# Altium schematic sheet interface.SchDoc: USB Interface (part 2 of 3)
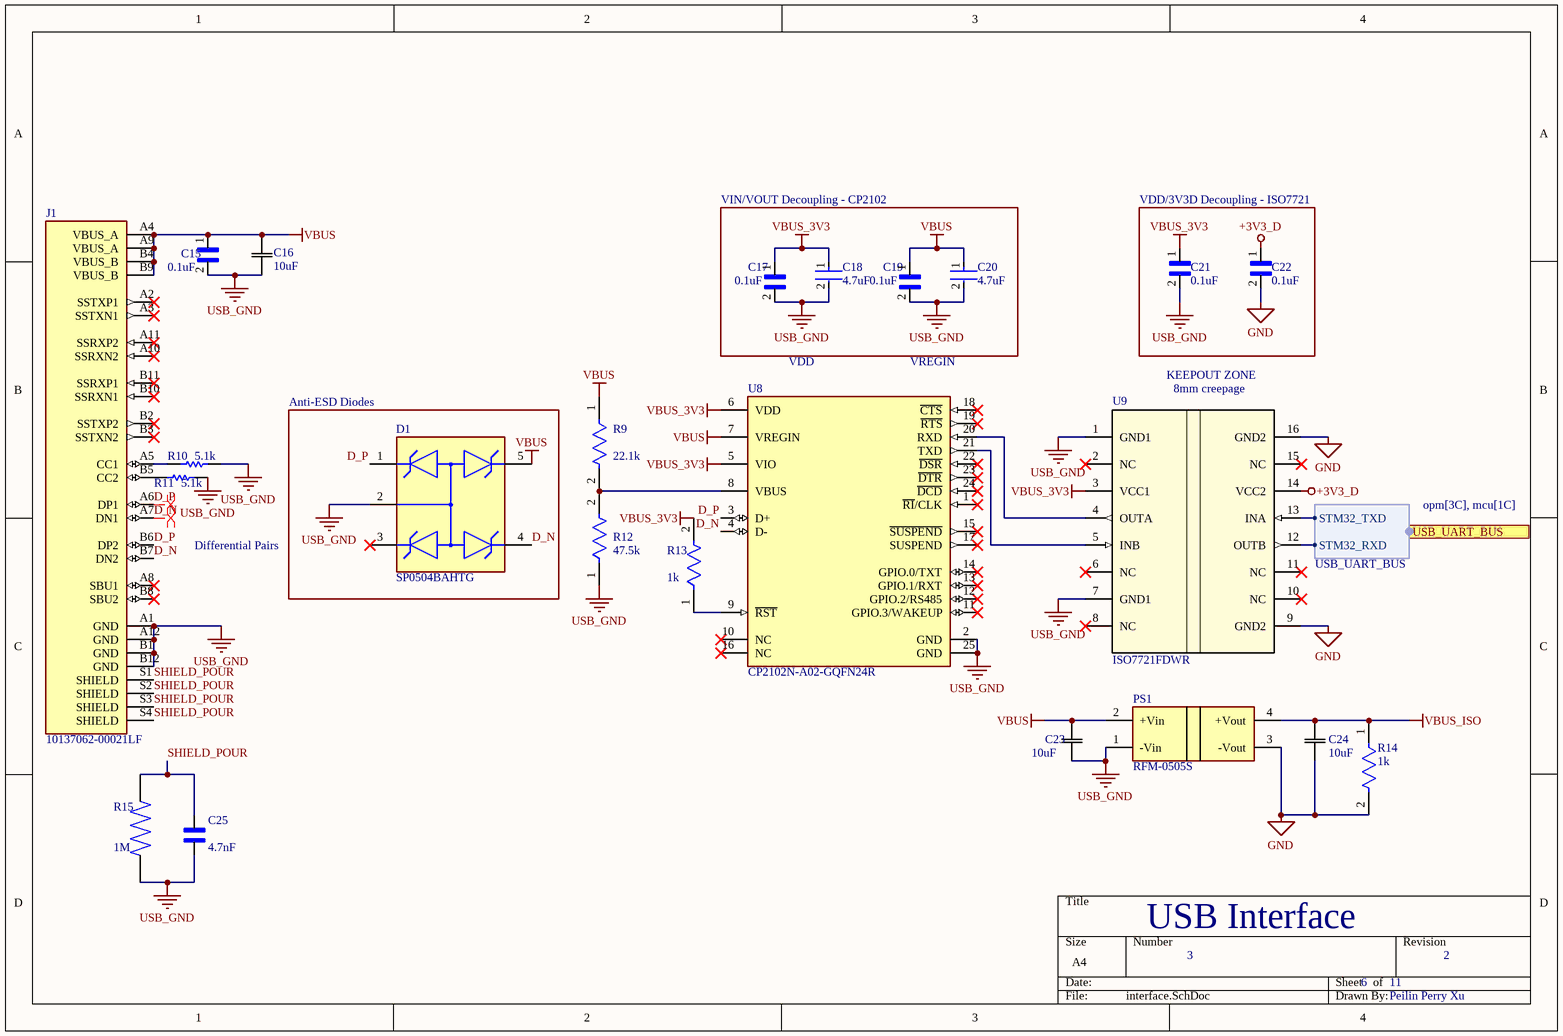
[diagram p1: interface.SchDoc]
## Library data of the parts
C15 C17 C19 C21 C22 = CC0603JRX7R8BB104: 25V 100nF X7R ±5% 0603 Multilayer Ceramic Capacitors MLCC - SMD/SMT ROHS; Manufacturer: Yageo Group; Supplier: DigiKey; Supplier Part Number: 311-1777-1-ND; Manufacturer Part Number: CC0603JRX7R8BB104; RoHS: Compliant; Category: Ceramic Capacitors; Stock: 156739; Pricing: 1=0.1, 10=0.056, 50=0.0386, 100=0.0333, 500=0.02444, 1000=0.02172 (USD); Value: 100nF; Case/Package: 0603; Case Code (Imperial): 0603; Case Code (Metric): 1608; China RoHS: Compliant; Composition: Ceramic; Depth: 800µm; Dielectric: X7R; Dielectric Material: Ceramic; Halogen Free: Halogen Free; Height: 800µm; Lead Free: Lead Free; Length: 1.6mm; Lifecycle Status: Production; Max Operating Temperature: 125°C; Min Operating Temperature: -55°C; Mounting Technology: Surface Mount; Number of Terminals: 2; Radiation Hardening: No; REACH SVHC: Yes; Schedule B: 8532240020, 8532240020|8532240020, 8532240020|8532240020|8532240020, 8532240020|8532240020|8532240020|8532240020; Termination: SMD/SMT; Thickness: 889µm; Tolerance: 5%; Voltage Rating: 25V; Voltage Rating (DC): 25V; Weight: 2.012816mg; Width: 800µm; ComponentLink1URL: https://datasheet.octopart.com:443/CC0603JRX7R8BB104-Yageo-datasheet-177165144.pdf?src-supplier=IHS; ComponentLink1Description: https://datasheet.octopart.com:443/CC0603JRX7R8BB104-Yageo-datasheet-177165144.pdf?src-supplier=IHS; ComponentLink2URL: https://datasheet.octopart.com:443/CC0603JRX7R8BB104-Yageo-datasheet-147453679.pdf?src-supplier=Farnell; ComponentLink2Description: https://datasheet.octopart.com:443/CC0603JRX7R8BB104-Yageo-datasheet-147453679.pdf?src-supplier=Farnell; ComponentLink3URL: https://datasheet.octopart.com:443/CC0603JRX7R8BB104-Yageo-datasheet-181968346.pdf?src-supplier=Farnell; ComponentLink3Description: https://datasheet.octopart.com:443/CC0603JRX7R8BB104-Yageo-datasheet-181968346.pdf?src-supplier=Farnell; ComponentLink4URL: https://datasheet.octopart.com:443/CC0603JRX7R8BB104-Yageo-datasheet-151948686.pdf?src-supplier=TME; ComponentLink4Description: https://datasheet.octopart.com:443/CC0603JRX7R8BB104-Yageo-datasheet-151948686.pdf?src-supplier=TME; ComponentLink5URL: https://datasheet.octopart.com/CC0603JRX7R8BB104-Yageo-datasheet-12526321.pdf; ComponentLink5Description: https://datasheet.octopart.com/CC0603JRX7R8BB104-Yageo-datasheet-12526321.pdf; ComponentLink6URL: https://datasheet.octopart.com/CC0603JRX7R8BB104-Yageo-datasheet-10883670.pdf; ComponentLink6Description: https://datasheet.octopart.com/CC0603JRX7R8BB104-Yageo-datasheet-10883670.pdf; ComponentLink7URL: https://datasheet.octopart.com:443/CC0603JRX7R8BB104-Yageo-datasheet-166511530.pdf?src-supplier=Future+Electronics; ComponentLink7Description: https://datasheet.octopart.com:443/CC0603JRX7R8BB104-Yageo-datasheet-166511530.pdf?src-supplier=Future+Electronics; ComponentLink8URL: https://datasheet.octopart.com:443/CC0603JRX7R8BB104-Yageo-datasheet-137700082.pdf?src-supplier=Future+Electronics; ComponentLink8Description: https://datasheet.octopart.com:443/CC0603JRX7R8BB104-Yageo-datasheet-137700082.pdf?src-supplier=Future+Electronics; ComponentLink9URL: https://datasheet.octopart.com:443/CC0603JRX7R8BB104-Yageo-datasheet-137700084.pdf?src-supplier=Future+Electronics; ComponentLink9Description: https://datasheet.octopart.com:443/CC0603JRX7R8BB104-Yageo-datasheet-137700084.pdf?src-supplier=Future+Electronics; ComponentLink10URL: https://datasheet.octopart.com:443/CC0603JRX7R8BB104-Yageo-datasheet-27626582.pdf?src-supplier=Future+Electronics; ComponentLink10Description: https://datasheet.octopart.com:443/CC0603JRX7R8BB104-Yageo-datasheet-27626582.pdf?src-supplier=Future+Electronics; ComponentLink11URL: https://datasheet.octopart.com:443/CC0603JRX7R8BB104-Yageo-datasheet-15895757.pdf?src-supplier=Future+Electronics; ComponentLink11Description: https://datasheet.octopart.com:443/CC0603JRX7R8BB104-Yageo-datasheet-15895757.pdf?src-supplier=Future+Electronics; ComponentLink12URL: https://datasheet.octopart.com:443/CC0603JRX7R8BB104-Yageo-datasheet-10911834.pdf?src-supplier=Future+Electronics; ComponentLink12Description: https://datasheet.octopart.com:443/CC0603JRX7R8BB104-Yageo-datasheet-10911834.pdf?src-supplier=Future+Electronics; ComponentLink13URL: https://datasheet.octopart.com:443/CC0603JRX7R8BB104-Yageo-datasheet-8324442.pdf?src-supplier=Future+Electronics; ComponentLink13Description: https://datasheet.octopart.com:443/CC0603JRX7R8BB104-Yageo-datasheet-8324442.pdf?src-supplier=Future+Electronics; ComponentLink14URL: https://datasheet.octopart.com:443/CC0603JRX7R8BB104-Yageo-Group-datasheet-165992755.pdf?src-supplier=ODG+(Origin+Data+Global); ComponentLink14Description: https://datasheet.octopart.com:443/CC0603JRX7R8BB104-Yageo-Group-datasheet-165992755.pdf?src-supplier=ODG+(Origin+Data+Global); ComponentLink15URL: http://sigma.octopart.com:80/rohs_statement/Surface-Mount-Ceramic-Multilayer-Capacitors%3B-General-Purpose-%26-High-Capacitance-Class-2%2C-X7R-Yageo-family-124.pdf?src-supplier=Compliance+Statements; ComponentLink15Description: http://sigma.octopart.com:80/rohs_statement/Surface-Mount-Ceramic-Multilayer-Capacitors%3B-General-Purpose-%26-High-Capacitance-Class-2%2C-X7R-Yageo-family-124.pdf?src-supplier=Compliance+Statements; ComponentLink16URL: http://sigma.octopart.com:80/reach_statement/Surface-Mount-Ceramic-Multilayer-Capacitors%3B-General-Purpose-%26-High-Capacitance-Class-2%2C-X7R-Yageo-family-125.pdf?src-supplier=Compliance+Statements; ComponentLink16Description: http://sigma.octopart.com:80/reach_statement/Surface-Mount-Ceramic-Multilayer-Capacitors%3B-General-Purpose-%26-High-Capacitance-Class-2%2C-X7R-Yageo-family-125.pdf?src-supplier=Compliance+Statements; ComponentLink17URL: http://sigma.octopart.com:80/conflict_mineral_statement/Yageo-company-3.pdf?src-supplier=Compliance+Statements; ComponentLink17Description: http://sigma.octopart.com:80/conflict_mineral_statement/Yageo-company-3.pdf?src-supplier=Compliance+Statements; ComponentLink18URL: http://sigma.octopart.com:80/rohs_statement/Yageo-company-2.pdf?src-supplier=Compliance+Statements; ComponentLink18Description: http://sigma.octopart.com:80/rohs_statement/Yageo-company-2.pdf?src-supplier=Compliance+Statements; Supplier 1: DigiKey; Supplier Part Number 1: 311-1777-1-ND
C16 C23 C24 = CC0805KKX7R7BB106: 16V 10uF X7R ±10% 0805 Multilayer Ceramic Capacitors MLCC - SMD/SMT ROHS; Manufacturer: Yageo Group; Value: 10µF; Supplier: DigiKey; Supplier Part Number: 311-3501-1-ND; Manufacturer Part Number: CC0805KKX7R7BB106; RoHS: Compliant; Category: Ceramic Capacitors; Stock: 2785; Pricing: 1=0.54, 10=0.329, 50=0.2472, 100=0.2222, 500=0.17992, 1000=0.16687 (USD); Case/Package: 0805; China RoHS: Compliant; Country of Origin: Mainland China, Taiwan; Dielectric: X7R; Dielectric Material: Ceramic; Export Control Classification Number (ECCN) Code: EAR99; Halogen Free: Halogen Free; Height: 1.25mm; Harmonized Tariff Schedule (HTS) Code: 8532.24.00.20; Introduction Date: 2013-05-20; Lead Free: Lead Free; Length: 2mm; Lifecycle Status: Production; Max Operating Temperature: 125°C; Min Operating Temperature: -55°C; Mounting Technology: Surface Mount; Number of Terminals: 2; REACH SVHC: Yes; Voltage Rating (DC): 16V; Width: 1.25mm; ComponentLink1URL: https://datasheet.octopart.com:443/CC0805KKX7R7BB106-Yageo-datasheet-177165144.pdf?src-supplier=IHS; ComponentLink1Description: https://datasheet.octopart.com:443/CC0805KKX7R7BB106-Yageo-datasheet-177165144.pdf?src-supplier=IHS; ComponentLink2URL: https://datasheet.octopart.com:443/CC0805KKX7R7BB106-Yageo-Group-datasheet-189192896.pdf?src-supplier=TME; ComponentLink2Description: https://datasheet.octopart.com:443/CC0805KKX7R7BB106-Yageo-Group-datasheet-189192896.pdf?src-supplier=TME; ComponentLink3URL: https://datasheet.octopart.com:443/CC0805KKX7R7BB106-Yageo-datasheet-147453679.pdf?src-supplier=Farnell; ComponentLink3Description: https://datasheet.octopart.com:443/CC0805KKX7R7BB106-Yageo-datasheet-147453679.pdf?src-supplier=Farnell; ComponentLink4URL: https://datasheet.octopart.com:443/CC0805KKX7R7BB106-Yageo-datasheet-181969636.pdf?src-supplier=Farnell; ComponentLink4Description: https://datasheet.octopart.com:443/CC0805KKX7R7BB106-Yageo-datasheet-181969636.pdf?src-supplier=Farnell; ComponentLink5URL: https://datasheet.octopart.com:443/CC0805KKX7R7BB106-Yageo-datasheet-151948686.pdf?src-supplier=Farnell; ComponentLink5Description: https://datasheet.octopart.com:443/CC0805KKX7R7BB106-Yageo-datasheet-151948686.pdf?src-supplier=Farnell; ComponentLink6URL: https://datasheet.octopart.com:443/CC0805KKX7R7BB106-Yageo-datasheet-166511530.pdf?src-supplier=Future+Electronics; ComponentLink6Description: https://datasheet.octopart.com:443/CC0805KKX7R7BB106-Yageo-datasheet-166511530.pdf?src-supplier=Future+Electronics; ComponentLink7URL: https://datasheet.octopart.com:443/CC0805KKX7R7BB106-Yageo-Group-datasheet-165992755.pdf?src-supplier=ODG+(Origin+Data+Global); ComponentLink7Description: https://datasheet.octopart.com:443/CC0805KKX7R7BB106-Yageo-Group-datasheet-165992755.pdf?src-supplier=ODG+(Origin+Data+Global); ComponentLink8URL: https://datasheet.octopart.com/CC0805KKX7R7BB106-Yageo-datasheet-10883670.pdf; ComponentLink8Description: https://datasheet.octopart.com/CC0805KKX7R7BB106-Yageo-datasheet-10883670.pdf; ComponentLink9URL: http://sigma.octopart.com:80/conflict_mineral_statement/Yageo-company-3.pdf?src-supplier=Compliance+Statements; ComponentLink9Description: http://sigma.octopart.com:80/conflict_mineral_statement/Yageo-company-3.pdf?src-supplier=Compliance+Statements; ComponentLink10URL: http://sigma.octopart.com:80/rohs_statement/Yageo-company-2.pdf?src-supplier=Compliance+Statements; ComponentLink10Description: http://sigma.octopart.com:80/rohs_statement/Yageo-company-2.pdf?src-supplier=Compliance+Statements; Supplier 1: DigiKey; Supplier Part Number 1: 311-3501-1-ND
C18 C20 = CC0805KKX7R7BB475: 16V 4.7uF X7R ±10% 0805 Multilayer Ceramic Capacitors MLCC - SMD/SMT ROHS; Manufacturer: Yageo Group; Manufacturer Package Identifier: CC0805-0.85; Value: 4.7µF; Supplier: DigiKey; Supplier Part Number: 311-1883-1-ND; Manufacturer Part Number: CC0805KKX7R7BB475; RoHS: Compliant; Category: Ceramic Capacitors; Stock: 16960; Pricing: 1=0.38, 10=0.224, 50=0.1656, 100=0.1475, 500=0.11696, 1000=0.10755 (USD); Case/Package: 0805; Case Code (Imperial): 0805; Case Code (Metric): 2012; China RoHS: Compliant; Composition: Ceramic; Dielectric: X7R; Dielectric Material: Ceramic; Halogen Free: Halogen Free; Height: 1.25mm; Lead Free: Lead Free; Length: 2mm; Lifecycle Status: Production; Material: Ceramic; Max Operating Temperature: 125°C; Min Operating Temperature: -55°C; Mounting Technology: Surface Mount; Number of Terminals: 2; Packaging: Tape & Reel (TR); REACH SVHC: Yes; Schedule B: 8532240020, 8532240020|8532240020, 8532240020|8532240020|8532240020, 8532240020|8532240020|8532240020|8532240020; Termination: SMD/SMT; Thickness: 1.4478mm; Tolerance: 10%; Voltage Rating: 16V; Voltage Rating (DC): 16V; Weight: 5.499807mg; Width: 1.25mm; ComponentLink1URL: https://datasheet.octopart.com:443/CC0805KKX7R7BB475-Yageo-datasheet-177165144.pdf?src-supplier=IHS; ComponentLink1Description: https://datasheet.octopart.com:443/CC0805KKX7R7BB475-Yageo-datasheet-177165144.pdf?src-supplier=IHS; ComponentLink2URL: https://datasheet.octopart.com:443/CC0805KKX7R7BB475-Yageo-datasheet-78855689.pdf?src-supplier=Upverter; ComponentLink2Description: https://datasheet.octopart.com:443/CC0805KKX7R7BB475-Yageo-datasheet-78855689.pdf?src-supplier=Upverter; ComponentLink3URL: https://datasheet.octopart.com:443/CC0805KKX7R7BB475-Yageo-datasheet-181969646.pdf?src-supplier=Newark; ComponentLink3Description: https://datasheet.octopart.com:443/CC0805KKX7R7BB475-Yageo-datasheet-181969646.pdf?src-supplier=Newark; ComponentLink4URL: https://datasheet.octopart.com:443/CC0805KKX7R7BB475-Yageo-datasheet-181969644.pdf?src-supplier=Newark; ComponentLink4Description: https://datasheet.octopart.com:443/CC0805KKX7R7BB475-Yageo-datasheet-181969644.pdf?src-supplier=Newark; ComponentLink5URL: https://datasheet.octopart.com:443/CC0805KKX7R7BB475-Yageo-datasheet-140260305.pdf?src-supplier=Newark; ComponentLink5Description: https://datasheet.octopart.com:443/CC0805KKX7R7BB475-Yageo-datasheet-140260305.pdf?src-supplier=Newark; ComponentLink6URL: https://datasheet.octopart.com:443/CC0805KKX7R7BB475-Yageo-datasheet-147453679.pdf?src-supplier=Newark; ComponentLink6Description: https://datasheet.octopart.com:443/CC0805KKX7R7BB475-Yageo-datasheet-147453679.pdf?src-supplier=Newark; ComponentLink7URL: https://datasheet.octopart.com:443/CC0805KKX7R7BB475-Yageo-Group-datasheet-188689702.pdf?src-supplier=Farnell; ComponentLink7Description: https://datasheet.octopart.com:443/CC0805KKX7R7BB475-Yageo-Group-datasheet-188689702.pdf?src-supplier=Farnell; ComponentLink8URL: https://datasheet.octopart.com:443/CC0805KKX7R7BB475-Yageo-datasheet-166511530.pdf?src-supplier=Future+Electronics; ComponentLink8Description: https://datasheet.octopart.com:443/CC0805KKX7R7BB475-Yageo-datasheet-166511530.pdf?src-supplier=Future+Electronics; ComponentLink9URL: https://datasheet.octopart.com:443/CC0805KKX7R7BB475-Yageo-datasheet-137700082.pdf?src-supplier=Future+Electronics; ComponentLink9Description: https://datasheet.octopart.com:443/CC0805KKX7R7BB475-Yageo-datasheet-137700082.pdf?src-supplier=Future+Electronics; ComponentLink10URL: https://datasheet.octopart.com:443/CC0805KKX7R7BB475-Yageo-datasheet-27626582.pdf?src-supplier=Future+Electronics; ComponentLink10Description: https://datasheet.octopart.com:443/CC0805KKX7R7BB475-Yageo-datasheet-27626582.pdf?src-supplier=Future+Electronics; ComponentLink11URL: https://datasheet.octopart.com:443/CC0805KKX7R7BB475-Yageo-Group-datasheet-165992755.pdf?src-supplier=ODG+(Origin+Data+Global); ComponentLink11Description: https://datasheet.octopart.com:443/CC0805KKX7R7BB475-Yageo-Group-datasheet-165992755.pdf?src-supplier=ODG+(Origin+Data+Global); ComponentLink12URL: https://datasheet.octopart.com:443/CC0805KKX7R7BB475-Yageo-datasheet-151948686.pdf?src-supplier=TME; ComponentLink12Description: https://datasheet.octopart.com:443/CC0805KKX7R7BB475-Yageo-datasheet-151948686.pdf?src-supplier=TME; ComponentLink13URL: https://datasheet.octopart.com/Surface-Mount-Ceramic-Multilayer-Capacitors%3B-General-Purpose-%26-High-Capacitance-Class-2%2C-X7R-Yageo-datasheet-family-114.pdf; ComponentLink13Description: https://datasheet.octopart.com/Surface-Mount-Ceramic-Multilayer-Capacitors%3B-General-Purpose-%26-High-Capacitance-Class-2%2C-X7R-Yageo-datasheet-family-114.pdf; ComponentLink14URL: https://datasheet.octopart.com/CC0805KKX7R7BB475-Yageo-datasheet-10883670.pdf; ComponentLink14Description: https://datasheet.octopart.com/CC0805KKX7R7BB475-Yageo-datasheet-10883670.pdf; ComponentLink15URL: http://sigma.octopart.com:80/rohs_statement/Surface-Mount-Ceramic-Multilayer-Capacitors%3B-General-Purpose-%26-High-Capacitance-Class-2%2C-X7R-Yageo-family-124.pdf?src-supplier=Compliance+Statements; ComponentLink15Description: http://sigma.octopart.com:80/rohs_statement/Surface-Mount-Ceramic-Multilayer-Capacitors%3B-General-Purpose-%26-High-Capacitance-Class-2%2C-X7R-Yageo-family-124.pdf?src-supplier=Compliance+Statements; ComponentLink16URL: http://sigma.octopart.com:80/reach_statement/Surface-Mount-Ceramic-Multilayer-Capacitors%3B-General-Purpose-%26-High-Capacitance-Class-2%2C-X7R-Yageo-family-125.pdf?src-supplier=Compliance+Statements; ComponentLink16Description: http://sigma.octopart.com:80/reach_statement/Surface-Mount-Ceramic-Multilayer-Capacitors%3B-General-Purpose-%26-High-Capacitance-Class-2%2C-X7R-Yageo-family-125.pdf?src-supplier=Compliance+Statements; ComponentLink17URL: http://sigma.octopart.com:80/conflict_mineral_statement/Yageo-company-3.pdf?src-supplier=Compliance+Statements; ComponentLink17Description: http://sigma.octopart.com:80/conflict_mineral_statement/Yageo-company-3.pdf?src-supplier=Compliance+Statements; ComponentLink18URL: http://sigma.octopart.com:80/rohs_statement/Yageo-company-2.pdf?src-supplier=Compliance+Statements; ComponentLink18Description: http://sigma.octopart.com:80/rohs_statement/Yageo-company-2.pdf?src-supplier=Compliance+Statements; Supplier 1: DigiKey; Supplier Part Number 1: 311-1883-6-ND
C25 = VJ1206Y472KXEAT5Z: Multilayer Ceramic Capacitor, 4700 pF, 500 V, ± 10%, X7R, 1206 [3216 Metric]; Manufacturer: Vishay; Voltage Rating: 500V; Supplier: DigiKey; Supplier Part Number: 720-1031-1-ND; Manufacturer Part Number: VJ1206Y472KXEAT5Z; RoHS: Compliant; Category: Ceramic Capacitors; Stock: 10395; Pricing: 1=1.07, 10=0.674, 50=0.5412, 100=0.4947, 500=0.4161, 1000=0.3918 (USD); Value: 4.7nF; Case/Package: 1206; Case Code (Imperial): 1206; Case Code (Metric): 3216; China RoHS: Compliant; Country of Origin: Israel; Dielectric: X7R; Dielectric Material: Ceramic; Export Control Classification Number (ECCN) Code: EAR99; Height: 1.7mm; Harmonized Tariff Schedule (HTS) Code: 8532.24.00.20; Introduction Date: 2007-05-08; Lead Free: Lead Free; Length: 3.2mm; Lifecycle Status: Production; Max Operating Temperature: 125°C; Min Operating Temperature: -55°C; Mounting Technology: Surface Mount; Number of Terminals: 2; Packaging: Digi-Reel®; REACH SVHC: Yes; Termination: SMD/SMT; Thickness: 1.7018mm; Tolerance: 10%; Voltage Rating (DC): 500V; Width: 1.6mm; ComponentLink1URL: https://datasheet.octopart.com:443/VJ1206Y472KXEAT5Z-Vishay-datasheet-159617168.pdf?src-supplier=Farnell; ComponentLink1Description: https://datasheet.octopart.com:443/VJ1206Y472KXEAT5Z-Vishay-datasheet-159617168.pdf?src-supplier=Farnell; ComponentLink2URL: https://datasheet.octopart.com:443/VJ1206Y472KXEAT5Z-Vishay-datasheet-149523907.pdf?src-supplier=element14+APAC; ComponentLink2Description: https://datasheet.octopart.com:443/VJ1206Y472KXEAT5Z-Vishay-datasheet-149523907.pdf?src-supplier=element14+APAC; ComponentLink3URL: https://datasheet.octopart.com:443/VJ1206Y472KXEAT5Z-Vishay-datasheet-13557233.pdf?src-supplier=Factory+Futures; ComponentLink3Description: https://datasheet.octopart.com:443/VJ1206Y472KXEAT5Z-Vishay-datasheet-13557233.pdf?src-supplier=Factory+Futures; ComponentLink4URL: https://datasheet.octopart.com:443/VJ1206Y472KXEAT5Z-Vishay-datasheet-12552536.pdf?src-supplier=Factory+Futures; ComponentLink4Description: https://datasheet.octopart.com:443/VJ1206Y472KXEAT5Z-Vishay-datasheet-12552536.pdf?src-supplier=Factory+Futures; ComponentLink5URL: https://datasheet.octopart.com:443/VJ1206Y472KXEAT5Z-Vishay-datasheet-12538810.pdf?src-supplier=Factory+Futures; ComponentLink5Description: https://datasheet.octopart.com:443/VJ1206Y472KXEAT5Z-Vishay-datasheet-12538810.pdf?src-supplier=Factory+Futures; ComponentLink6URL: https://datasheet.octopart.com:443/VJ1206Y472KXEAT5Z-Vishay-datasheet-12527091.pdf?src-supplier=Factory+Futures; ComponentLink6Description: https://datasheet.octopart.com:443/VJ1206Y472KXEAT5Z-Vishay-datasheet-12527091.pdf?src-supplier=Factory+Futures; ComponentLink7URL: https://datasheet.octopart.com:443/VJ1206Y472KXEAT5Z-Vishay-datasheet-12511790.pdf?src-supplier=Factory+Futures; ComponentLink7Description: https://datasheet.octopart.com:443/VJ1206Y472KXEAT5Z-Vishay-datasheet-12511790.pdf?src-supplier=Factory+Futures; ComponentLink8URL: https://datasheet.octopart.com:443/VJ1206Y472KXEAT5Z-Vishay-datasheet-12511142.pdf?src-supplier=Factory+Futures; ComponentLink8Description: https://datasheet.octopart.com:443/VJ1206Y472KXEAT5Z-Vishay-datasheet-12511142.pdf?src-supplier=Factory+Futures; ComponentLink9URL: https://datasheet.octopart.com:443/VJ1206Y472KXEAT5Z-Vishay-datasheet-15670510.pdf?src-supplier=Future+Electronics; ComponentLink9Description: https://datasheet.octopart.com:443/VJ1206Y472KXEAT5Z-Vishay-datasheet-15670510.pdf?src-supplier=Future+Electronics; ComponentLink10URL: https://datasheet.octopart.com:443/VJ1206Y472KXEAT5Z-Vishay-datasheet-10404631.pdf?src-supplier=Future+Electronics; ComponentLink10Description: https://datasheet.octopart.com:443/VJ1206Y472KXEAT5Z-Vishay-datasheet-10404631.pdf?src-supplier=Future+Electronics; ComponentLink11URL: https://datasheet.octopart.com:443/VJ1206Y472KXEAT5Z-Vishay-datasheet-10052095.pdf?src-supplier=Future+Electronics; ComponentLink11Description: https://datasheet.octopart.com:443/VJ1206Y472KXEAT5Z-Vishay-datasheet-10052095.pdf?src-supplier=Future+Electronics; ComponentLink12URL: https://datasheet.octopart.com:443/VJ1206Y472KXEAT5Z-Vishay-datasheet-8361628.pdf?src-supplier=Future+Electronics; ComponentLink12Description: https://datasheet.octopart.com:443/VJ1206Y472KXEAT5Z-Vishay-datasheet-8361628.pdf?src-supplier=Future+Electronics; ComponentLink13URL: https://datasheet.octopart.com:443/VJ1206Y472KXEAT5Z-Vishay-datasheet-5311911.pdf?src-supplier=Future+Electronics; ComponentLink13Description: https://datasheet.octopart.com:443/VJ1206Y472KXEAT5Z-Vishay-datasheet-5311911.pdf?src-supplier=Future+Electronics; ComponentLink14URL: https://datasheet.octopart.com/VJ1206Y472KXEAT5Z-Vishay-datasheet-14932079.pdf; ComponentLink14Description: https://datasheet.octopart.com/VJ1206Y472KXEAT5Z-Vishay-datasheet-14932079.pdf; ComponentLink15URL: http://sigma.octopart.com:80/rohs_statement/Vishay-company-15.pdf?src-supplier=Compliance+Statements; ComponentLink15Description: http://sigma.octopart.com:80/rohs_statement/Vishay-company-15.pdf?src-supplier=Compliance+Statements; Supplier 1: DigiKey; Supplier Part Number 1: 720-1031-1-ND
D1 = SP0504BAHTG: SP050xBA Series 8 V 30 pF Uni-Directional SMT TVS Avalanche Diode Array SOT-23-5; Manufacturer: Littelfuse; Breakdown Voltage: 5.5V; Value: 30pF; Clamping Voltage: 6.8V; Direction: Unidirectional; Element Configuration: Common Anode; ESD Protection: Yes; Leakage Current: 100nA; Max Power Dissipation: 225mW; Number of Channels: 4; Peak Pulse Power: 25W; Power Line Protection: No; Voltage Rating (DC): 5V; Supplier: DigiKey; Supplier Part Number: F3157CT-ND; Manufacturer Part Number: SP0504BAHTG; RoHS: Compliant; Category: TVS Diodes; Stock: 10352; Pricing: 1=0.84, 10=0.723, 100=0.529, 500=0.424, 1000=0.401, 3000=0.36652, 6000=0.32689 (USD); Case/Package: SOT-23; Composition: Zener; Country of Origin: Mainland China; Depth: 1.75mm; Diode Type: Avalanche; Export Control Classification Number (ECCN) Code: EAR99; Height: 1.45mm; Harmonized Tariff Schedule (HTS) Code: 8541.10.00.50; Introduction Date: 2002-07-25; Lead Free: Lead Free; Length: 3.05mm; Lifecycle Status: Production; Max Operating Temperature: 125°C; Max Reverse Leakage Current: 100nA; Min Operating Temperature: -40°C; Mounting Technology: Surface Mount; Number of Elements: 4; Pins: 5; Number of Terminals: 5; Number of Unidirectional Channels: 4; Operating Supply Voltage: 5.5V; Packaging: Cut Tape; Polarity: Unidirectional; Power Dissipation: 225mW; Radiation Hardening: No; REACH SVHC: Yes; Reverse Standoff Voltage: 5.5V; Schedule B: 8536300000, 8536300000|8536300000, 8536300000|8536300000|8536300000, 8536300000|8536300000|8536300000|8536300000; Termination: SMD/SMT; Width: 1.75mm; Working Voltage: 5.5V; ComponentLink1URL: https://datasheet.octopart.com:443/SP0504BAHTG-Littelfuse-datasheet-180609594.pdf?src-supplier=IHS; ComponentLink1Description: https://datasheet.octopart.com:443/SP0504BAHTG-Littelfuse-datasheet-180609594.pdf?src-supplier=IHS; ComponentLink2URL: https://datasheet.octopart.com:443/SP0504BAHTG-Littelfuse-datasheet-137315643.pdf?src-supplier=JRH+Electronics; ComponentLink2Description: https://datasheet.octopart.com:443/SP0504BAHTG-Littelfuse-datasheet-137315643.pdf?src-supplier=JRH+Electronics; ComponentLink3URL: https://datasheet.octopart.com:443/SP0504BAHTG-Littelfuse-datasheet-65933529.pdf?src-supplier=element14+APAC; ComponentLink3Description: https://datasheet.octopart.com:443/SP0504BAHTG-Littelfuse-datasheet-65933529.pdf?src-supplier=element14+APAC; ComponentLink4URL: https://datasheet.octopart.com:443/SP0504BAHTG-Littelfuse-datasheet-14434284.pdf?src-supplier=element14+APAC; ComponentLink4Description: https://datasheet.octopart.com:443/SP0504BAHTG-Littelfuse-datasheet-14434284.pdf?src-supplier=element14+APAC; ComponentLink5URL: https://datasheet.octopart.com:443/SP0504BAHTG-Littelfuse-datasheet-165517320.pdf?src-supplier=Newark; ComponentLink5Description: https://datasheet.octopart.com:443/SP0504BAHTG-Littelfuse-datasheet-165517320.pdf?src-supplier=Newark; ComponentLink6URL: https://datasheet.octopart.com:443/SP0504BAHTG-Littelfuse-datasheet-8328482.pdf?src-supplier=Newark; ComponentLink6Description: https://datasheet.octopart.com:443/SP0504BAHTG-Littelfuse-datasheet-8328482.pdf?src-supplier=Newark; ComponentLink7URL: https://datasheet.octopart.com:443/SP0504BAHTG-Littelfuse-datasheet-32996.pdf?src-supplier=Newark; ComponentLink7Description: https://datasheet.octopart.com:443/SP0504BAHTG-Littelfuse-datasheet-32996.pdf?src-supplier=Newark; ComponentLink8URL: https://datasheet.octopart.com:443/SP0504BAHTG-Littelfuse-datasheet-173467575.pdf?src-supplier=Future+Electronics; ComponentLink8Description: https://datasheet.octopart.com:443/SP0504BAHTG-Littelfuse-datasheet-173467575.pdf?src-supplier=Future+Electronics; ComponentLink9URL: https://datasheet.octopart.com:443/SP0504BAHTG-Littelfuse-datasheet-125842.pdf?src-supplier=Future+Electronics; ComponentLink9Description: https://datasheet.octopart.com:443/SP0504BAHTG-Littelfuse-datasheet-125842.pdf?src-supplier=Future+Electronics; ComponentLink10URL: https://datasheet.octopart.com:443/SP0504BAHTG-Littelfuse-datasheet-43099464.pdf?src-supplier=RS+(Formerly+Allied+Electronics); ComponentLink10Description: https://datasheet.octopart.com:443/SP0504BAHTG-Littelfuse-datasheet-43099464.pdf?src-supplier=RS+(Formerly+Allied+Electronics); ComponentLink11URL: https://datasheet.octopart.com:443/SP0504BAHTG-Littelfuse-datasheet-14049100.pdf?src-supplier=iiiC; ComponentLink11Description: https://datasheet.octopart.com:443/SP0504BAHTG-Littelfuse-datasheet-14049100.pdf?src-supplier=iiiC; ComponentLink12URL: https://datasheet.octopart.com:443/SP0504BAHTG-Littelfuse-datasheet-8817999.pdf?src-supplier=Farnell; ComponentLink12Description: https://datasheet.octopart.com:443/SP0504BAHTG-Littelfuse-datasheet-8817999.pdf?src-supplier=Farnell; ComponentLink13URL: https://datasheet.octopart.com:443/SP0504BAHTG-Littelfuse-datasheet-622385.pdf?src-supplier=Fuses+Unlimited; ComponentLink13Description: https://datasheet.octopart.com:443/SP0504BAHTG-Littelfuse-datasheet-622385.pdf?src-supplier=Fuses+Unlimited; Supplier 1: DigiKey; Supplier Part Number 1: F3157CT-ND
J1 = 10137062-00021LF: Conn USB Type C Receptacle 24 POS 0.5mm RA Surface Mount/Through Hole Single Port T/R; Manufacturer: Amphenol Communications Solutions; Dielectric Material: Polyethylene; Number of Contacts: 24; Number of Ports: 1; Plating Thickness: 762nm; USB Standard: USB 3.1; Voltage Rating: 100V; Supplier: DigiKey; Supplier Part Number: 609-6109-1-ND; Manufacturer Part Number: 10137062-00021LF; RoHS: Compliant; Category: USB Connectors; Stock: 7299; Pricing: 1=2.19, 10=1.857, 25=1.74, 50=1.657, 100=1.5777, 250=1.47888, 500=1.40828 (USD); Contact Gender: Male; Contact Material: Gold, Nickel; Height: 3.5mm; Lifecycle Status: Production; Max Operating Temperature: 85°C; Min Operating Temperature: -55°C; Pins: 24; Orientation: Horizontal; REACH SVHC: Yes; Schedule B: 8536695050, 8536695050|8536695050|8536695050|8536695050|8536695050|8536695050|8536695050|8536695050|8536695050|8536695050|8536695050|8536695050|8536695050|8536695050|8536695050|8536695050|8536695050|8536695050|8536695050|8536695050|8536695050|8536695050|8536695050|85; Shell Finish: Nickel; Shell Material: Stainless Steel; ComponentLink1URL: https://datasheet.octopart.com:443/10137062-00021LF-Amphenol-Communications-Solutions-datasheet-182241635.pdf?src-supplier=IHS; ComponentLink1Description: https://datasheet.octopart.com:443/10137062-00021LF-Amphenol-Communications-Solutions-datasheet-182241635.pdf?src-supplier=IHS; ComponentLink2URL: https://datasheet.octopart.com:443/10137062-00021LF-Amphenol-Communications-Solutions-datasheet-168215092.pdf?src-supplier=Master+Electronics; ComponentLink2Description: https://datasheet.octopart.com:443/10137062-00021LF-Amphenol-Communications-Solutions-datasheet-168215092.pdf?src-supplier=Master+Electronics; ComponentLink3URL: https://datasheet.octopart.com:443/10137062-00021LF-Amphenol-Communications-Solutions-datasheet-100454240.pdf?src-supplier=Newark; ComponentLink3Description: https://datasheet.octopart.com:443/10137062-00021LF-Amphenol-Communications-Solutions-datasheet-100454240.pdf?src-supplier=Newark; Supplier 1: DigiKey; Supplier Part Number 1: 609-6109-1-ND
PS1 = RFM-0505S: DC/DC Converter ; 1W; Vin: 4.5-5.5V; Vout: 5V; Iout: 20mA; -40+85deg.C; THT; SIP4; Manufacturer: Recom Power; Max Supply Voltage: 5.5V; Max Output Voltage: 5.25V; Min Input Voltage: 4.5V; Min Output Voltage: 4.75V; Nominal Supply Current: 25mA; Number of Circuits: 1; Output Current: 200mA; Switching Frequency: 80kHz; Supplier: DigiKey; Supplier Part Number: 945-3159-ND; Manufacturer Part Number: RFM-0505S; RoHS: Compliant; Category: Voltage Regulators - Switching; Stock: 17910; Pricing: 1=1.93, 5=1.854, 10=1.825, 25=1.7856, 50=1.7568, 100=1.7283, 250=1.69128, 500=1.66378 (USD); Height: 10mm; Height - Seated (Max): 10.5mm; Length: 11.5mm; Lifecycle Status: Production; Max Operating Temperature: 85°C; Max Output Power: 1W; Max Power Dissipation: 1W; Min Operating Temperature: -40°C; Min Supply Voltage: 4.5V; Nominal Supply Voltage: 5V; Nominal Output Voltage: 5V; Number of Outputs: 1; Number of Terminals: 4; Output Power: 1W; Output Voltage: 5V; REACH SVHC: Yes; Schedule B: 8504409580, 8504409580|8504409580|8504409580|8504409580|8504409580; Temperature Grade: Industrial; Terminal Pitch: 2.54mm; Weight: 1.4g; Width: 6mm; ComponentLink1URL: https://datasheet.octopart.com:443/RFM-0505S-Recom-Power-datasheet-133924900.pdf?src-supplier=Farnell; ComponentLink1Description: https://datasheet.octopart.com:443/RFM-0505S-Recom-Power-datasheet-133924900.pdf?src-supplier=Farnell; ComponentLink2URL: https://datasheet.octopart.com:443/RFM-0505S-Recom-Power-datasheet-104425650.pdf?src-supplier=element14+APAC; ComponentLink2Description: https://datasheet.octopart.com:443/RFM-0505S-Recom-Power-datasheet-104425650.pdf?src-supplier=element14+APAC; Supplier 1: DigiKey; Supplier Part Number 1: 945-3159-ND
R9 = RC0603FR-0722K1L: Res General Purpose Thick Film 0603 22.1K Ohm 1% 1/10W ±100ppm/°C Molded SMD Paper T/R; Manufacturer: Yageo Group; Power Dissipation: 100mW; Value: 22.1kΩ; Voltage Rating: 75V; Voltage Rating (DC): 50V; Supplier: DigiKey; Supplier Part Number: 311-22.1KHRCT-ND; Manufacturer Part Number: RC0603FR-0722K1L; RoHS: Compliant; Category: Chip SMD Resistors; Stock: 528025; Pricing: 1=0.1, 10=0.006, 25=0.0056 (USD); Case/Package: 0603; Case Code (Imperial): 0603; Case Code (Metric): 1608; China RoHS: Non-Compliant; Composition: Thick Film; Country of Origin: Mainland China, Taiwan; Export Control Classification Number (ECCN) Code: EAR99; Height: 450µm; Harmonized Tariff Schedule (HTS) Code: 8533.21.00.30; Introduction Date: 2004-09-22; Lead Free: Lead Free; Length: 1.6mm; Lifecycle Status: Production; Max Operating Temperature: 155°C; Min Operating Temperature: -55°C; Mounting Technology: Surface Mount; Number of Terminals: 2; Power Rating: 100mW; REACH SVHC: Yes; Schedule B: 8533210045, 8533210045|8533210045, 8533210045|8533210045|8533210045, 8533210045|8533210045|8533210045|8533210045; Temperature Coefficient: 100ppm/°C; Termination: SMD/SMT; Tolerance: 1%; Width: 800µm; Working Voltage: 75V; ComponentLink1URL: https://datasheet.octopart.com:443/RC0603FR-0722K1L-Yageo-datasheet-175887523.pdf?src-supplier=IHS; ComponentLink1Description: https://datasheet.octopart.com:443/RC0603FR-0722K1L-Yageo-datasheet-175887523.pdf?src-supplier=IHS; ComponentLink2URL: https://datasheet.octopart.com:443/RC0603FR-0722K1L-Yageo-datasheet-141265859.pdf?src-supplier=Upverter; ComponentLink2Description: https://datasheet.octopart.com:443/RC0603FR-0722K1L-Yageo-datasheet-141265859.pdf?src-supplier=Upverter; ComponentLink3URL: https://datasheet.octopart.com:443/RC0603FR-0722K1L-Yageo-datasheet-103092701.pdf?src-supplier=Upverter; ComponentLink3Description: https://datasheet.octopart.com:443/RC0603FR-0722K1L-Yageo-datasheet-103092701.pdf?src-supplier=Upverter; ComponentLink4URL: https://sigma.octopart.com:443/138820526/technical_drawing/Yageo-RC0603FR-0722K1L.pdf?src-supplier=Upverter; ComponentLink4Description: https://sigma.octopart.com:443/138820526/technical_drawing/Yageo-RC0603FR-0722K1L.pdf?src-supplier=Upverter; ComponentLink5URL: https://datasheet.octopart.com:443/RC0603FR-0722K1L-Yageo-Group-datasheet-190305687.pdf?src-supplier=Newark; ComponentLink5Description: https://datasheet.octopart.com:443/RC0603FR-0722K1L-Yageo-Group-datasheet-190305687.pdf?src-supplier=Newark; ComponentLink6URL: https://datasheet.octopart.com:443/RC0603FR-0722K1L-Yageo-datasheet-62067350.pdf?src-supplier=Newark; ComponentLink6Description: https://datasheet.octopart.com:443/RC0603FR-0722K1L-Yageo-datasheet-62067350.pdf?src-supplier=Newark; ComponentLink7URL: https://datasheet.octopart.com:443/RC0603FR-0722K1L-Yageo-datasheet-8328172.pdf?src-supplier=Future+Electronics; ComponentLink7Description: https://datasheet.octopart.com:443/RC0603FR-0722K1L-Yageo-datasheet-8328172.pdf?src-supplier=Future+Electronics; ComponentLink8URL: https://datasheet.octopart.com:443/RC0603FR-0722K1L-Yageo-Group-datasheet-176638170.pdf?src-supplier=Future+Electronics; ComponentLink8Description: https://datasheet.octopart.com:443/RC0603FR-0722K1L-Yageo-Group-datasheet-176638170.pdf?src-supplier=Future+Electronics; ComponentLink9URL: https://datasheet.octopart.com:443/RC0603FR-0722K1L-Yageo-datasheet-164759695.pdf?src-supplier=Future+Electronics; ComponentLink9Description: https://datasheet.octopart.com:443/RC0603FR-0722K1L-Yageo-datasheet-164759695.pdf?src-supplier=Future+Electronics; ComponentLink10URL: https://datasheet.octopart.com:443/RC0603FR-0722K1L-Yageo-datasheet-137700087.pdf?src-supplier=Future+Electronics; ComponentLink10Description: https://datasheet.octopart.com:443/RC0603FR-0722K1L-Yageo-datasheet-137700087.pdf?src-supplier=Future+Electronics; ComponentLink11URL: https://datasheet.octopart.com:443/RC0603FR-0722K1L-Yageo-datasheet-27584510.pdf?src-supplier=Future+Electronics; ComponentLink11Description: https://datasheet.octopart.com:443/RC0603FR-0722K1L-Yageo-datasheet-27584510.pdf?src-supplier=Future+Electronics; ComponentLink12URL: https://datasheet.octopart.com:443/RC0603FR-0722K1L-Yageo-datasheet-15599030.pdf?src-supplier=Future+Electronics; ComponentLink12Description: https://datasheet.octopart.com:443/RC0603FR-0722K1L-Yageo-datasheet-15599030.pdf?src-supplier=Future+Electronics; ComponentLink13URL: https://datasheet.octopart.com:443/RC0603FR-0722K1L-Yageo-datasheet-12596169.pdf?src-supplier=Future+Electronics; ComponentLink13Description: https://datasheet.octopart.com:443/RC0603FR-0722K1L-Yageo-datasheet-12596169.pdf?src-supplier=Future+Electronics; ComponentLink14URL: https://datasheet.octopart.com:443/RC0603FR-0722K1L-Yageo-datasheet-8324193.pdf?src-supplier=Future+Electronics; ComponentLink14Description: https://datasheet.octopart.com:443/RC0603FR-0722K1L-Yageo-datasheet-8324193.pdf?src-supplier=Future+Electronics; ComponentLink15URL: https://datasheet.octopart.com:443/RC0603FR-0722K1L-Yageo-datasheet-148775077.pdf?src-supplier=TME; ComponentLink15Description: https://datasheet.octopart.com:443/RC0603FR-0722K1L-Yageo-datasheet-148775077.pdf?src-supplier=TME; ComponentLink16URL: https://datasheet.octopart.com:443/RC0603FR-0722K1L-Yageo-datasheet-79472498.pdf?src-supplier=Megastar; ComponentLink16Description: https://datasheet.octopart.com:443/RC0603FR-0722K1L-Yageo-datasheet-79472498.pdf?src-supplier=Megastar; ComponentLink17URL: https://datasheet.octopart.com/RC0603FR-0722K1L-Yageo-datasheet-73766026.pdf; ComponentLink17Description: https://datasheet.octopart.com/RC0603FR-0722K1L-Yageo-datasheet-73766026.pdf; ComponentLink18URL: http://sigma.octopart.com:80/conflict_mineral_statement/Yageo-company-3.pdf?src-supplier=Compliance+Statements; ComponentLink18Description: http://sigma.octopart.com:80/conflict_mineral_statement/Yageo-company-3.pdf?src-supplier=Compliance+Statements; ComponentLink19URL: http://sigma.octopart.com:80/rohs_statement/Yageo-company-2.pdf?src-supplier=Compliance+Statements; ComponentLink19Description: http://sigma.octopart.com:80/rohs_statement/Yageo-company-2.pdf?src-supplier=Compliance+Statements; Supplier 1: DigiKey; Supplier Part Number 1: 311-22.1KHRCT-ND
R10 R11 = RC0603FR-075K1L: Res Thick Film 0603 5.1K Ohm 1% 0.1W(1/10W) ±100ppm/C Pad SMD T/R; Manufacturer: Yageo Group; Max Power Dissipation: 100mW; Value: 5.1kΩ; Temperature Coefficient: 100ppm/°C; Voltage Rating: 75V; Voltage Rating (DC): 50V; Supplier: DigiKey; Supplier Part Number: 311-5.10KHRCT-ND; Manufacturer Part Number: RC0603FR-075K1L; RoHS: Compliant; Category: Chip SMD Resistors; Stock: 539386; Pricing: 1=0.1, 10=0.007, 25=0.0068, 50=0.0062, 100=0.0057 (USD); Case/Package: 0603; Case Code (Imperial): 0603; China RoHS: Non-Compliant; Composition: Thick Film; Depth: 800µm; Features: Moisture Resistant; Height: 450µm; Lead Free: Lead Free; Lifecycle Status: Production; Max Operating Temperature: 155°C; Military Standard: Not; Min Operating Temperature: -55°C; Mounting Technology: Surface Mount; Pins: 2; Number of Terminals: 2; Number of Terminations: 2; Packaging: Tape & Reel; Power Dissipation: 100mW; Power Rating: 100mW; REACH SVHC: Yes; Schedule B: 8533210045, 8533210045|8533210045, 8533210045|8533210045|8533210045, 8533210045|8533210045|8533210045|8533210045; Termination: SMD/SMT; Tolerance: 1%; Width: 800µm; Working Voltage: 75V; ComponentLink1URL: https://datasheet.octopart.com:443/RC0603FR-075K1L-Yageo-datasheet-175887523.pdf?src-supplier=IHS; ComponentLink1Description: https://datasheet.octopart.com:443/RC0603FR-075K1L-Yageo-datasheet-175887523.pdf?src-supplier=IHS; ComponentLink2URL: https://datasheet.octopart.com:443/RC0603FR-075K1L-Yageo-datasheet-103092701.pdf?src-supplier=Upverter; ComponentLink2Description: https://datasheet.octopart.com:443/RC0603FR-075K1L-Yageo-datasheet-103092701.pdf?src-supplier=Upverter; ComponentLink3URL: https://datasheet.octopart.com:443/RC0603FR-075K1L-Yageo-Group-datasheet-190305687.pdf?src-supplier=Newark; ComponentLink3Description: https://datasheet.octopart.com:443/RC0603FR-075K1L-Yageo-Group-datasheet-190305687.pdf?src-supplier=Newark; ComponentLink4URL: https://datasheet.octopart.com:443/RC0603FR-075K1L-Yageo-datasheet-8328172.pdf?src-supplier=Farnell; ComponentLink4Description: https://datasheet.octopart.com:443/RC0603FR-075K1L-Yageo-datasheet-8328172.pdf?src-supplier=Farnell; ComponentLink5URL: https://datasheet.octopart.com:443/RC0603FR-075K1L-Yageo-datasheet-62067350.pdf?src-supplier=Farnell; ComponentLink5Description: https://datasheet.octopart.com:443/RC0603FR-075K1L-Yageo-datasheet-62067350.pdf?src-supplier=Farnell; ComponentLink6URL: https://datasheet.octopart.com:443/RC0603FR-075K1L-Yageo-datasheet-34211833.pdf?src-supplier=element14+APAC; ComponentLink6Description: https://datasheet.octopart.com:443/RC0603FR-075K1L-Yageo-datasheet-34211833.pdf?src-supplier=element14+APAC; ComponentLink7URL: https://datasheet.octopart.com:443/RC0603FR-075K1L-Yageo-Group-datasheet-176638170.pdf?src-supplier=Future+Electronics; ComponentLink7Description: https://datasheet.octopart.com:443/RC0603FR-075K1L-Yageo-Group-datasheet-176638170.pdf?src-supplier=Future+Electronics; ComponentLink8URL: https://datasheet.octopart.com:443/RC0603FR-075K1L-Yageo-datasheet-164759695.pdf?src-supplier=Future+Electronics; ComponentLink8Description: https://datasheet.octopart.com:443/RC0603FR-075K1L-Yageo-datasheet-164759695.pdf?src-supplier=Future+Electronics; ComponentLink9URL: https://datasheet.octopart.com:443/RC0603FR-075K1L-Yageo-datasheet-137700087.pdf?src-supplier=Future+Electronics; ComponentLink9Description: https://datasheet.octopart.com:443/RC0603FR-075K1L-Yageo-datasheet-137700087.pdf?src-supplier=Future+Electronics; ComponentLink10URL: https://datasheet.octopart.com:443/RC0603FR-075K1L-Yageo-datasheet-15599030.pdf?src-supplier=Future+Electronics; ComponentLink10Description: https://datasheet.octopart.com:443/RC0603FR-075K1L-Yageo-datasheet-15599030.pdf?src-supplier=Future+Electronics; ComponentLink11URL: https://datasheet.octopart.com:443/RC0603FR-075K1L-Yageo-datasheet-12596169.pdf?src-supplier=Future+Electronics; ComponentLink11Description: https://datasheet.octopart.com:443/RC0603FR-075K1L-Yageo-datasheet-12596169.pdf?src-supplier=Future+Electronics; ComponentLink12URL: https://datasheet.octopart.com:443/RC0603FR-075K1L-Yageo-datasheet-503470.pdf?src-supplier=Future+Electronics; ComponentLink12Description: https://datasheet.octopart.com:443/RC0603FR-075K1L-Yageo-datasheet-503470.pdf?src-supplier=Future+Electronics; ComponentLink13URL: https://datasheet.octopart.com:443/RC0603FR-075K1L-Yageo-datasheet-148775077.pdf?src-supplier=TME; ComponentLink13Description: https://datasheet.octopart.com:443/RC0603FR-075K1L-Yageo-datasheet-148775077.pdf?src-supplier=TME; ComponentLink14URL: https://datasheet.octopart.com:443/RC0603FR-075K1L-Yageo-datasheet-79472498.pdf?src-supplier=Megastar; ComponentLink14Description: https://datasheet.octopart.com:443/RC0603FR-075K1L-Yageo-datasheet-79472498.pdf?src-supplier=Megastar; ComponentLink15URL: https://datasheet.octopart.com/RC0603FR-075K1L-Yageo-datasheet-73766026.pdf; ComponentLink15Description: https://datasheet.octopart.com/RC0603FR-075K1L-Yageo-datasheet-73766026.pdf; ComponentLink16URL: https://datasheet.octopart.com:443/RC0603FR-075K1L-Yageo-datasheet-118562.pdf?src-supplier=DigiKey; ComponentLink16Description: https://datasheet.octopart.com:443/RC0603FR-075K1L-Yageo-datasheet-118562.pdf?src-supplier=DigiKey; ComponentLink17URL: http://sigma.octopart.com:80/conflict_mineral_statement/Yageo-company-3.pdf?src-supplier=Compliance+Statements; ComponentLink17Description: http://sigma.octopart.com:80/conflict_mineral_statement/Yageo-company-3.pdf?src-supplier=Compliance+Statements; ComponentLink18URL: http://sigma.octopart.com:80/rohs_statement/Yageo-company-2.pdf?src-supplier=Compliance+Statements; ComponentLink18Description: http://sigma.octopart.com:80/rohs_statement/Yageo-company-2.pdf?src-supplier=Compliance+Statements; Supplier 1: DigiKey; Supplier Part Number 1: 311-5.10KHRCT-ND
R12 = RC0603FR-0747K5L: 100mW Thick Film Resistors 75V ±100ppm/℃ ±1% 47.5kΩ 0603 Chip Resistor - Surface Mount ROHS; Manufacturer: Yageo Group; Temperature Coefficient: 100ppm/°C; Voltage Rating (DC): 50V; Supplier: DigiKey; Supplier Part Number: 311-47.5KHRCT-ND; Manufacturer Part Number: RC0603FR-0747K5L; RoHS: Compliant; Category: Chip SMD Resistors; Stock: 42231; Pricing: 1=0.11, 10=0.008, 25=0.0076, 50=0.0072, 100=0.0068, 250=0.00568 (USD); Case/Package: 0603; Case Code (Imperial): 0603; China RoHS: Non-Compliant; Composition: Thick Film; Country of Origin: Mainland China, Taiwan; Depth: 800µm; Export Control Classification Number (ECCN) Code: EAR99; Features: Moisture Resistant; Height: 450µm; Harmonized Tariff Schedule (HTS) Code: 8533.21.00.30; Introduction Date: 2004-09-22; Lead Free: Lead Free; Length: 1.6mm; Lifecycle Status: Production; Max Operating Temperature: 155°C; Max Power Dissipation: 100mW; Military Standard: Not; Min Operating Temperature: -55°C; Mounting Technology: Surface Mount; Pins: 2; Number of Terminals: 2; Number of Terminations: 2; Packaging: Tape & Reel; Power Dissipation: 100mW; Power Rating: 100mW; REACH SVHC: Yes; Value: 47.5kΩ; Schedule B: 8533210045, 8533210045|8533210045|8533210045|8533210045|8533210045|8533210045|8533210045|8533210045|8533210045|8533210045|8533210045|8533210045|8533210045|8533210045|8533210045, 8533210045|8533210045|8533210045|8533210045|8533210045|8533210045|8533210045|8533210045|8533210045|8533210045|8533210045|8533210045|8533210045|8533210045|8533210045|8533210045, 8533210045|8533210045|8533210045|8533210045|8533210045|8533210045|8533210045|8533210045|8533210045|8533210045|8533210045|8533210045|8533210045|8533210045|8533210045|8533210045|8533210045; Termination: SMD/SMT; Tolerance: 1%; Voltage Rating: 75V; Width: 800µm; Working Voltage: 75V; ComponentLink1URL: https://datasheet.octopart.com:443/RC0603FR-0747K5L-Yageo-datasheet-175887523.pdf?src-supplier=IHS; ComponentLink1Description: https://datasheet.octopart.com:443/RC0603FR-0747K5L-Yageo-datasheet-175887523.pdf?src-supplier=IHS; ComponentLink2URL: https://datasheet.octopart.com:443/RC0603FR-0747K5L-Yageo-datasheet-103092701.pdf?src-supplier=Upverter; ComponentLink2Description: https://datasheet.octopart.com:443/RC0603FR-0747K5L-Yageo-datasheet-103092701.pdf?src-supplier=Upverter; ComponentLink3URL: https://datasheet.octopart.com:443/RC0603FR-0747K5L-Yageo-Group-datasheet-190305687.pdf?src-supplier=Newark; ComponentLink3Description: https://datasheet.octopart.com:443/RC0603FR-0747K5L-Yageo-Group-datasheet-190305687.pdf?src-supplier=Newark; ComponentLink4URL: https://datasheet.octopart.com:443/RC0603FR-0747K5L-Yageo-datasheet-8328172.pdf?src-supplier=Farnell; ComponentLink4Description: https://datasheet.octopart.com:443/RC0603FR-0747K5L-Yageo-datasheet-8328172.pdf?src-supplier=Farnell; ComponentLink5URL: https://datasheet.octopart.com:443/RC0603FR-0747K5L-Yageo-datasheet-62067350.pdf?src-supplier=Farnell; ComponentLink5Description: https://datasheet.octopart.com:443/RC0603FR-0747K5L-Yageo-datasheet-62067350.pdf?src-supplier=Farnell; ComponentLink6URL: https://datasheet.octopart.com:443/RC0603FR-0747K5L-Yageo-datasheet-34211833.pdf?src-supplier=element14+APAC; ComponentLink6Description: https://datasheet.octopart.com:443/RC0603FR-0747K5L-Yageo-datasheet-34211833.pdf?src-supplier=element14+APAC; ComponentLink7URL: https://datasheet.octopart.com:443/RC0603FR-0747K5L-Yageo-Group-datasheet-176638170.pdf?src-supplier=Future+Electronics; ComponentLink7Description: https://datasheet.octopart.com:443/RC0603FR-0747K5L-Yageo-Group-datasheet-176638170.pdf?src-supplier=Future+Electronics; ComponentLink8URL: https://datasheet.octopart.com:443/RC0603FR-0747K5L-Yageo-datasheet-164759695.pdf?src-supplier=Future+Electronics; ComponentLink8Description: https://datasheet.octopart.com:443/RC0603FR-0747K5L-Yageo-datasheet-164759695.pdf?src-supplier=Future+Electronics; ComponentLink9URL: https://datasheet.octopart.com:443/RC0603FR-0747K5L-Yageo-datasheet-137700087.pdf?src-supplier=Future+Electronics; ComponentLink9Description: https://datasheet.octopart.com:443/RC0603FR-0747K5L-Yageo-datasheet-137700087.pdf?src-supplier=Future+Electronics; ComponentLink10URL: https://datasheet.octopart.com:443/RC0603FR-0747K5L-Yageo-datasheet-27584510.pdf?src-supplier=Future+Electronics; ComponentLink10Description: https://datasheet.octopart.com:443/RC0603FR-0747K5L-Yageo-datasheet-27584510.pdf?src-supplier=Future+Electronics; ComponentLink11URL: https://datasheet.octopart.com:443/RC0603FR-0747K5L-Yageo-datasheet-15599030.pdf?src-supplier=Future+Electronics; ComponentLink11Description: https://datasheet.octopart.com:443/RC0603FR-0747K5L-Yageo-datasheet-15599030.pdf?src-supplier=Future+Electronics; ComponentLink12URL: https://datasheet.octopart.com:443/RC0603FR-0747K5L-Yageo-datasheet-12596169.pdf?src-supplier=Future+Electronics; ComponentLink12Description: https://datasheet.octopart.com:443/RC0603FR-0747K5L-Yageo-datasheet-12596169.pdf?src-supplier=Future+Electronics; ComponentLink13URL: https://datasheet.octopart.com:443/RC0603FR-0747K5L-Yageo-datasheet-503470.pdf?src-supplier=Future+Electronics; ComponentLink13Description: https://datasheet.octopart.com:443/RC0603FR-0747K5L-Yageo-datasheet-503470.pdf?src-supplier=Future+Electronics; ComponentLink14URL: https://datasheet.octopart.com:443/RC0603FR-0747K5L-Yageo-datasheet-148775077.pdf?src-supplier=TME; ComponentLink14Description: https://datasheet.octopart.com:443/RC0603FR-0747K5L-Yageo-datasheet-148775077.pdf?src-supplier=TME; ComponentLink15URL: https://datasheet.octopart.com/RC0603FR-0747K5L-Yageo-datasheet-73766026.pdf; ComponentLink15Description: https://datasheet.octopart.com/RC0603FR-0747K5L-Yageo-datasheet-73766026.pdf; ComponentLink16URL: https://datasheet.octopart.com:443/RC0603FR-0747K5L-Yageo-datasheet-118562.pdf?src-supplier=DigiKey; ComponentLink16Description: https://datasheet.octopart.com:443/RC0603FR-0747K5L-Yageo-datasheet-118562.pdf?src-supplier=DigiKey; ComponentLink17URL: http://sigma.octopart.com:80/conflict_mineral_statement/Yageo-company-3.pdf?src-supplier=Compliance+Statements; ComponentLink17Description: http://sigma.octopart.com:80/conflict_mineral_statement/Yageo-company-3.pdf?src-supplier=Compliance+Statements; ComponentLink18URL: http://sigma.octopart.com:80/rohs_statement/Yageo-company-2.pdf?src-supplier=Compliance+Statements; ComponentLink18Description: http://sigma.octopart.com:80/rohs_statement/Yageo-company-2.pdf?src-supplier=Compliance+Statements; Supplier 1: DigiKey; Supplier Part Number 1: 311-47.5KHRCT-ND